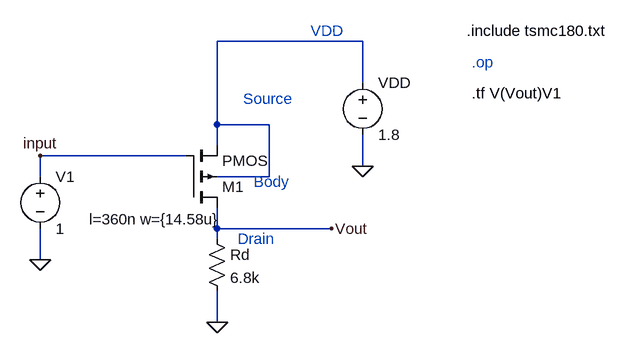
[diagram p0: schematic Pmos common source amplifier.asc]
Pmos common source amplifier.asc, the LTspice schematic file:
Version 4
SHEET 1 880 680
WIRE 432 -48 208 -48
WIRE 432 16 432 -48
WIRE 208 80 208 -48
WIRE 288 80 208 80
WIRE 208 112 208 80
WIRE 160 128 -64 128
WIRE 432 144 432 96
WIRE -64 160 -64 128
WIRE 288 160 288 80
WIRE 288 160 208 160
WIRE 208 240 208 208
WIRE 384 240 208 240
WIRE 208 256 208 240
WIRE -64 288 -64 240
WIRE 208 384 208 336
FLAG 208 384 0
FLAG -64 288 0
FLAG 432 144 0
FLAG -64 128 input
FLAG 384 240 Vout
SYMBOL pmos4 160 208 M180
WINDOW 123 -149 -18 Left 2
SYMATTR InstName M1
SYMATTR Value2 l=360n w={14.58u}
SYMBOL res 192 240 R0
SYMATTR InstName Rd
SYMATTR Value 6.8k
SYMBOL voltage 432 0 R0
WINDOW 123 0 0 Left 0
WINDOW 39 0 0 Left 0
SYMATTR InstName VDD
SYMATTR Value 1.8
SYMBOL voltage -64 144 R0
SYMATTR InstName V1
SYMATTR Value 1
TEXT 240 256 Left 2 ;Drain
TEXT 248 40 Left 2 ;Source
TEXT 264 168 Left 2 ;Body
TEXT 352 -64 Left 2 ;VDD
TEXT 592 -64 Left 2 !.include tsmc180.txt
TEXT 600 -16 Left 2 ;.op
TEXT 600 32 Left 2 !.tf V(Vout)V1

The netlist it stands for:
* Pmos common source amplifier.asc
M1 Vout input N001 N001 PMOS l=360n w={14.58u}
Rd Vout 0 6.8k
VDD N001 0 1.8
V1 input 0 1
.model NMOS NMOS
.model PMOS PMOS
.lib standard.mos
* Drain
* Source
* Body
* VDD
.include tsmc180.txt
* .op
.tf V(Vout)V1
.backanno
.end